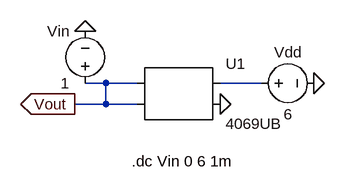
[diagram p0: schematic Q3.asc]
Q3.asc, the LTspice schematic file:
Version 4
SHEET 1 880 680
WIRE 64 -32 32 -32
WIRE 112 -32 64 -32
WIRE 304 -32 240 -32
WIRE 64 0 64 -32
WIRE 64 0 16 0
WIRE 112 0 64 0
FLAG 16 0 Vout
IOPIN 16 0 Out
FLAG 384 -32 0
FLAG 240 0 0
FLAG 32 -112 0
SYMBOL voltage 288 -32 R270
WINDOW 0 32 56 VTop 2
WINDOW 3 -32 56 VBottom 2
WINDOW 123 0 0 Left 0
WINDOW 39 0 0 Left 0
SYMATTR InstName Vdd
SYMATTR Value 6
SYMBOL AutoGenerated\\4069UB 176 -16 R0
SYMATTR InstName U1
SYMBOL voltage 32 -16 R180
WINDOW 0 24 96 Left 2
WINDOW 3 24 16 Left 2
WINDOW 123 0 0 Left 0
WINDOW 39 0 0 Left 0
SYMATTR InstName Vin
SYMATTR Value 1
TEXT 104 88 Left 2 !.dc Vin 0 6 1m

The netlist it stands for:
* Q3.asc
Vdd N001 0 6
* U1: 4069UB (symbol AutoGenerated\4069UB not available, pins judged from their places): pin1=Vout pin2=Vout pin3=N001 pin4=0
Vin Vout 0 1
.dc Vin 0 6 1m
.backanno
.end